# EAGLE design 223_gas (EAGLE 9.6.2)
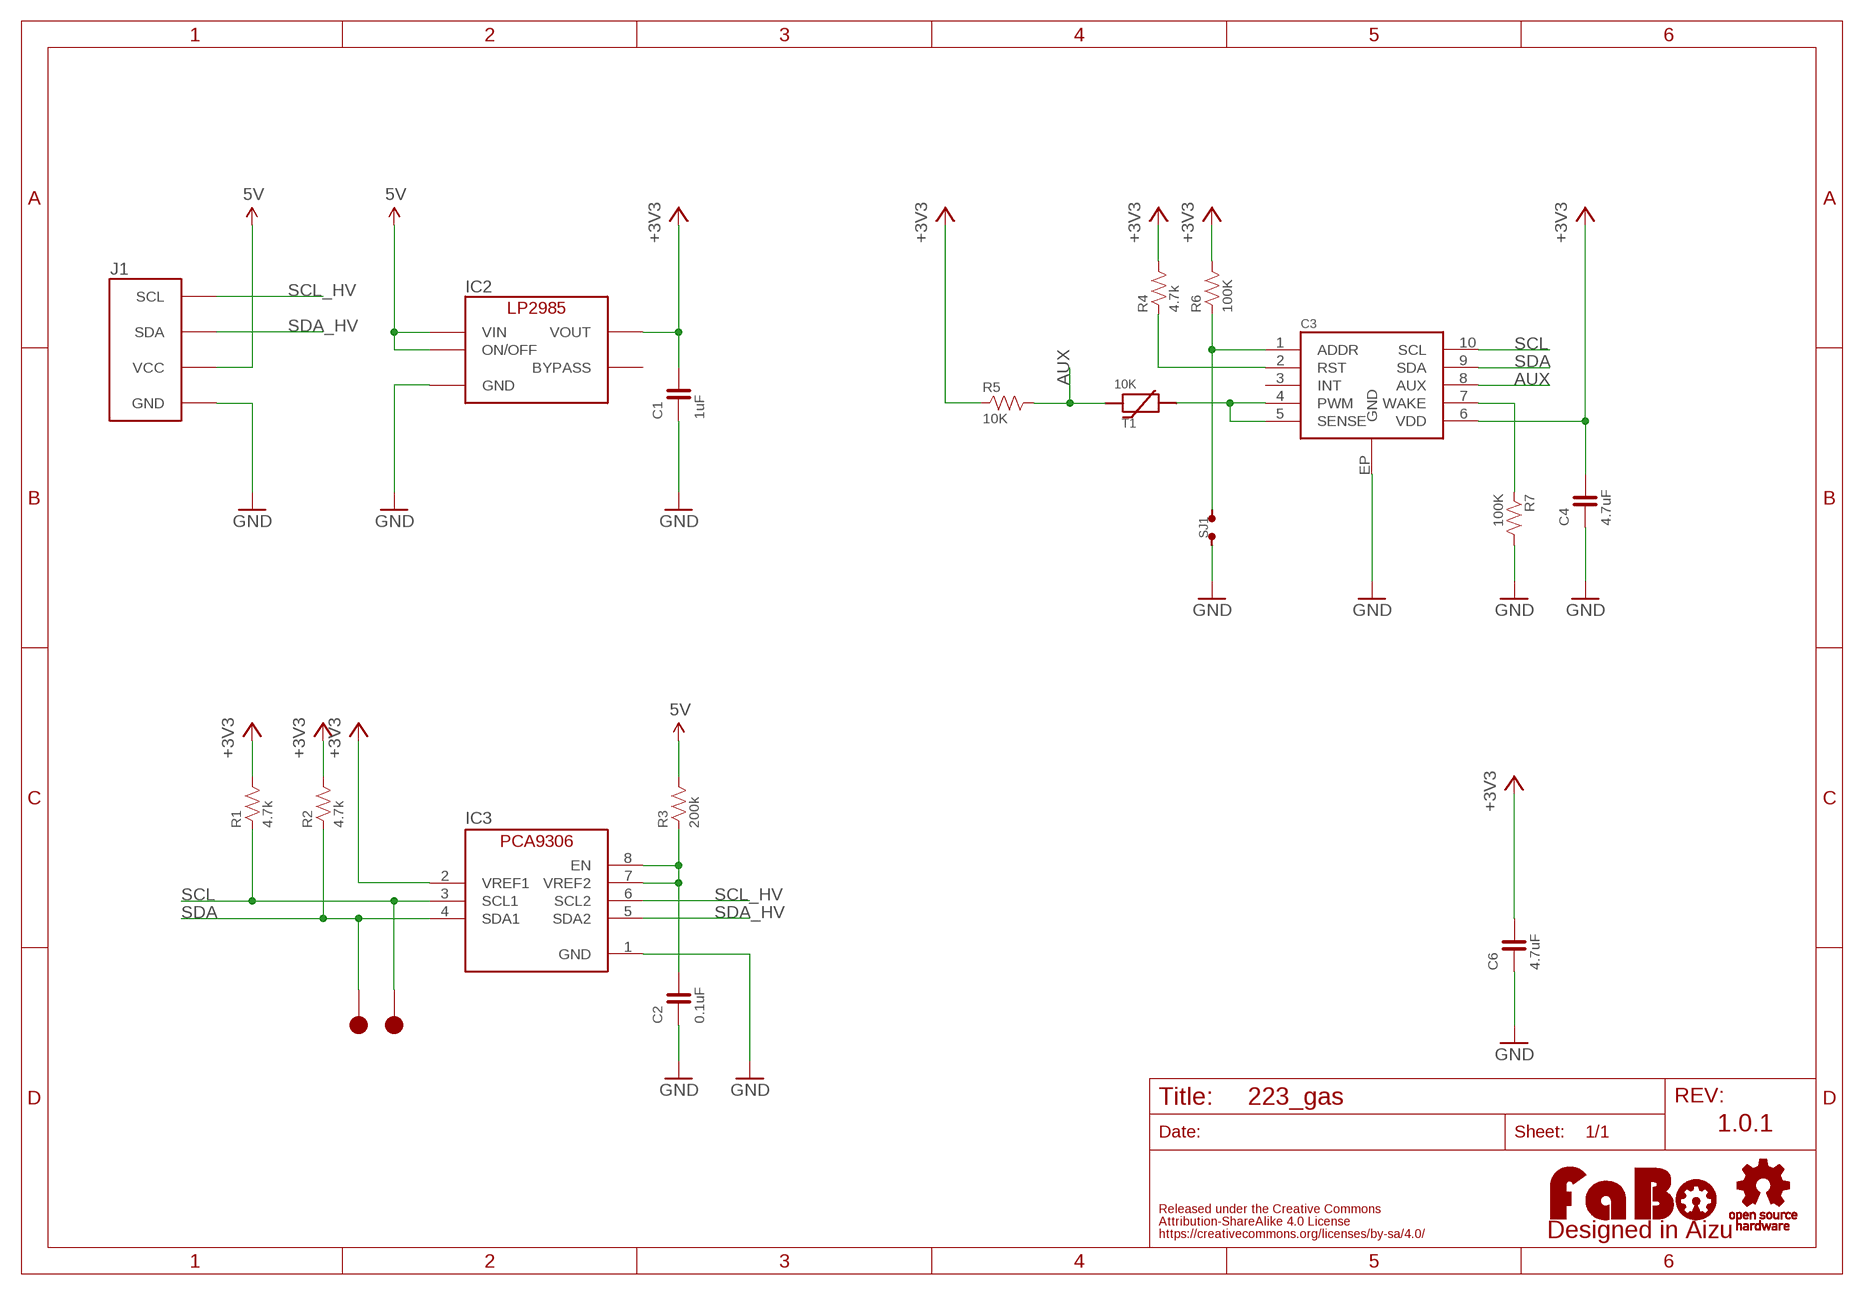
[diagram p0: schematic, sheet 1]

## Parts
C1  1uF  CAPACITOR-0603  [0603]
C2  0.1uF  CAPACITOR-0603  [0603]
C3  AM-CSS811  [AMS-CSS811]
C4  4.7uF  CAPACITOR-0603  [0603]
C6  4.7uF  CAPACITOR-0603  [0603]
IC2  LP2985-33DBV  [SOT-23-5]
IC3  PCA9306GM  [XQFN8]
J1  FABO_BRICK_I2C  [FABO_BRICK_I2C]
LOGO1  LOGO_FABO-M  [LOGO_FABO_M]
R1  4.7k  RESISTOR-0603  [0603]
R2  4.7k  RESISTOR-0603  [0603]
R3  200k  RESISTOR-0603  [0603]
R4  4.7k  RESISTOR-0603  [0603]
R5  10K  RESISTOR-0603  [0603]
R6  100K  RESISTOR-0603  [0603]
R7  100K  RESISTOR-0603  [0603]
SJ1  SMD-JUMPER-2-OPEN  [SMD-JUMPER-2-OPEN]
T1  10K  TERMISTOR  [0603]
TP1  TP-15  [TP-15]
TP2  TP-15  [TP-15]
U$2  LOGO_OSHW-M_BOTTOM  [LOGO_OSHW_M_BOTTOM]

## Nets
5V: IC2.1(VIN) IC2.3(ON/OFF) J1.VCC R3.2
+3V3: C1.2 C3.6(VDD) C4.2 C6.2 IC2.5(VOUT) IC3.2(VREF1) R1.2 R2.2 R4.2 R5.1 R6.2
AUX: C3.8(AUX) R5.2 T1.1
GND: C1.1 C2.1 C3.EP(GND) C4.1 C6.1 IC2.2(GND) IC3.1(GND) J1.GND R7.2 SJ1.1
N$1: C2.2 IC3.7(VREF2) IC3.8(EN) R3.1
N$2: C3.4(PWM) C3.5(SENSE) T1.2
N$3: C3.7(WAKE) R7.1
N$4: C3.2(RST) R4.1
N$5: C3.1(ADDR) R6.1 SJ1.2
SCL: C3.10(SCL) IC3.3(SCL1) R1.1 TP2.1
SCL_HV: IC3.6(SCL2) J1.SCL
SDA: C3.9(SDA) IC3.4(SDA1) R2.1 TP1.1
SDA_HV: IC3.5(SDA2) J1.SDA
Unconnected: C3.3(INT) IC2.4(BYPASS)

## Notes on the sheet
- 1.0.1

## Library data of the parts
C1 C2 C4 C6 = FaBo-Capacitor:CAPACITOR: CAPACITOR
C3 = FaBo-Mems:AM-CSS811
IC2 = FaBo-Supply:LP2985: LP2985
IC3 = FaBo-LevelTranslator:PCA9306
J1 = FaBo-Template:FABO_BRICK_I2C: FaBo Brick I2C
LOGO1 = component:LOGO_FABO
R1-R7 = FaBo-Resistors:RESISTOR: RESISTOR
SJ1 = FaBo-Supply:SMD-JUMPER-2
T1 = FaBo-Thermistors:TERMISTOR
TP1 TP2 = FaBo-Supply:TP
U$2 = component:LOGO_OSHW

## Board
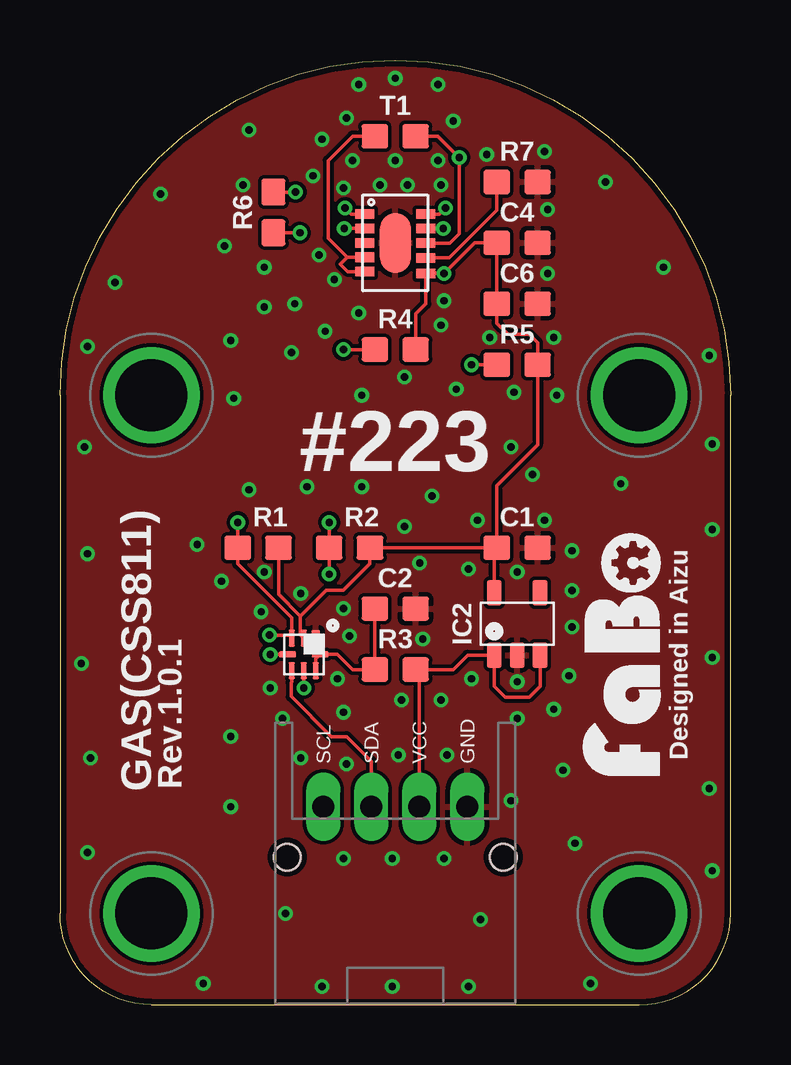
[diagram p1: board, top side]
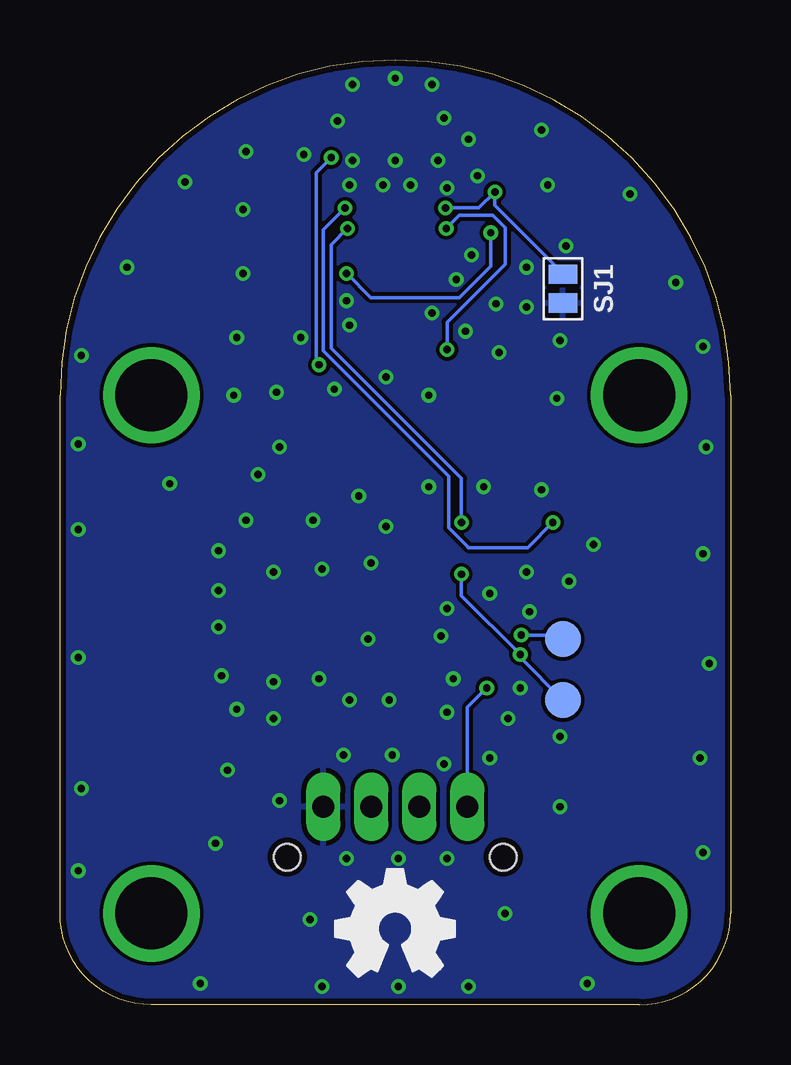
[diagram p2: board, bottom side, seen from below]

Size 27.94 x 39.37 mm. Coordinates in mm from the lower left corner, seen from the top.
Copper layers (1*16): Top 0.035mm / dielectric 1.6mm / Bottom 0.035mm
Design rules "PCBway": minimum track width 6mil, minimum drill 12mil, track to track 6mil, track to pad 6mil, pad to pad 6mil, via to via 6mil, smd to smd 6mil, copper to edge 10mil, drill to drill 10mil, minimum pad ring 10mil, minimum via ring 6mil, stop-mask expansion 2mil, vias tented up to drill 100mil, thermal gap 8mil

### Footprints (pad centres in the part's own frame; a part is rotated, then mirrored left to right if it is on the bottom)
0603 = smd 1.1 x 1: 1 -0.85,0; 2 0.85,0
AMS-CSS811 = smd 0.8 x 0.4: 1 -1.27,1.2; 2 -1.27,0.6; 3 -1.27,0; 4 -1.27,-0.6; 5 -1.27,-1.2; 6 1.27,-1.27; 7 1.27,-0.625; 8 1.27,-0.006; 9 1.27,0.6; 10 1.27,1.2 | smd 1.3 x 2.5: EP 0,0
SOT-23-5 = smd 0.6 x 1.05: 1 -0.95,-1.3; 2 0,-1.3; 3 0.95,-1.3; 4 0.95,1.3; 5 -0.95,1.3
XQFN8 = smd 0.7 x 0.35: 1 -0.675,0.5 | smd 0.7 x 0.25: 2 -0.675,0; 3 -0.675,-0.5; 5 0.675,-0.5; 6 0.675,0; 7 0.675,0.5 | smd 0.25 x 0.7: 4 0,-0.675; 8 0,0.675
FABO_BRICK_I2C = drill 0.9 pad 1.422 long: GND 3,-10.795; SCL -3,-10.795; SDA -1,-10.795; VCC 1,-10.795 | drill 3 pad 3.81: P$1 -10.16,6.35; P$2 10.16,6.35; P$3 -10.16,-15.24; P$4 10.16,-15.24 | hole 1.1: -4.5,-12.895; 4.5,-12.895
SMD-JUMPER-2-OPEN = smd 0.8 x 1.2: 1 -0.6,0; 2 0.6,0
TP-15 = smd 1.5 x 1.5: 1 0,0

### Placement (x,y rotation side)
C1  19.05,19.05 180 top
C2  13.97,16.51 180 top
C3  13.97,31.75 0 top
C4  19.05,31.75 180 top
C6  19.05,29.21 180 top
IC2  19.05,15.88 0 top
IC3  10.16,14.61 270 top
J1  13.97,19.05 0 top
LOGO1  25.4,14.61 90 top
R1  8.26,19.05 0 top
R2  12.06,19.05 0 top
R3  13.97,13.97 0 top
R4  13.97,27.3 0 top
R5  19.05,26.67 180 top
R6  8.89,33.02 270 top
R7  19.05,34.29 0 top
SJ1  6.99,29.84 90 bottom
T1  13.97,36.2 180 top
TP1  6.99,12.7 0 bottom
TP2  6.99,15.24 0 bottom
U$2  13.97,3.17 0 top

### Tracks (layer width: path | path; a pad name or v marks a point on that pad's centre or on a via)
5V
  Top 0.152: IC2.3 20,13.27 19.56,12.83 18.54,12.83 18.1,13.27 IC2.1 16.99,14.57 16.38,13.97 R3.2 14.97,13.82 J1.VCC
+3V3  (via drill 0.3)
  Top 0.152: IC2.5 18.1,18.95 | 18.1,18.95 C1.2 18.2,21.63 19.9,23.33 R5.1 19.9,27.6 19.56,27.94 18.67,27.94 18.2,28.41 C6.2 C4.2 17.27,31.75 v16,30.48 C3.6 15.24,29.21 14.82,28.79 R4.2 | R1.2 9.11,17.11 10.01,16.2 | IC3.2 10.01,15.43 10.01,16.2 | R6.2 v9.99,32.17 | 10.01,16.2 11.09,17.27 11.81,17.27 12.91,18.38 R2.2 18,19.05 18.1,18.95
  Bottom 0.152: v9.99,32.17 9.99,30.77 11.3,29.46 14.99,29.46 v16,30.48
AUX  (via drill 0.3)
  Top 0.152: C3.8 16.25,31.74 16.64,32.13 v16.64,35.31 15.75,36.2 T1.1 | R5.2 v17.14,26.67
  Bottom 0.152: v17.14,26.67 17.27,26.8 17.27,34.67 v16.64,35.31
GND  (via drill 0.3)
  other vias: 19.05,13.46 8.51,18.03 10.03,17.14 11.81,34.04 10.54,34.54 12.19,35.18 11.94,36.96 10.92,36.07 13.34,34.16 14.48,34.16 15.88,34.16 15.75,35.18 13.97,35.18 17.78,35.43 16.38,36.83 13.97,38.61 15.75,38.35 12.45,38.35 10.79,31.24 11.43,30.23 12.45,28.83 16,29.34 15.88,28.32 11.05,28.07 8.51,30.73 9.78,29.21 7.62,34.16 6.86,31.62 8.51,29.08 7.11,27.69 9.65,27.18 14.35,26.16 20.32,30.48 20.32,33.15 20.19,35.56 17.91,27.81 20.57,27.81 18.92,25.53 20.7,25.4 16.51,25.65 18.8,23.24 19.68,22.1 17.4,20.19 20.19,20.19 19.05,18.03 21.34,18.92 21.34,17.27 21.34,15.75 17.02,18.16 14.35,19.94 14.99,18.41 21.21,13.72 19.05,11.94 20.57,12.32 17.14,13.59 15.88,12.7 14.22,12.7 15.11,15.24 11.81,16.51 12.06,15.37 11.56,13.59 11.81,12.19 16.13,10.41 14.1,10.41 11.94,10.03 10.03,10.29 9.27,11.94 8.76,13.21 7.11,11.18 11.81,6.1 13.84,6.1 16,6.1 18.8,8.51 20.95,9.78 7.11,8.26 1.14,6.35 5.97,0.89 10.92,0.76 13.84,0.76 17.02,0.76 22.1,0.89 27.18,5.59 21.46,6.73 17.53,3.56 9.4,3.81 27.18,14.48 27.18,19.81 27.05,9.02 23.37,21.72 27.18,23.37 12.57,21.59 10.29,21.59 8.38,16.38 6.73,17.65 5.71,19.18 7.87,21.46 12.57,25.4 7.24,25.27 27.05,27.05 1.14,27.43 1.02,23.24 0.89,14.22 1.14,18.8 1.27,10.29 22.73,34.29 25.15,30.73 4.19,33.78 7.87,36.45 2.29,30.1 15.49,21.21
  pour Bottom: 0,0 0,39.37 27.94,39.37 27.94,0
  pour Top: 0,0 27.94,0 27.94,39.37 0,39.37
N$1
  Top 0.152: IC3.7 10.66,14.43 IC3.8 11.56,14.61 12.19,13.97 R3.1 C2.2
N$2
  Top 0.152: C3.4 11.97,31.15 | 11.97,31.15 11.68,30.86 11.99,30.55 C3.5 | T1.2 12.19,36.2 11.18,35.18 11.18,31.95 11.97,31.15
N$3
  Top 0.152: C3.7 16.22,31.12 18.2,33.11 R7.1
N$4  (via drill 0.3)
  Top 0.152: C3.2 v11.85,32.35 | R4.1 v11.81,27.3
  Bottom 0.152: v11.85,32.35 11.3,32.89 9.91,32.89 9.4,32.38 9.4,30.86 11.81,28.45 v11.81,27.3
N$5  (via drill 0.3)
  Top 0.152: C3.1 12.13,32.95 v11.88,33.2 | v9.82,33.87 R6.1
  Bottom 0.152: v11.88,33.2 10.48,33.2 v9.82,33.87 9.82,33.31 6.99,30.48 SJ1.2
SCL  (via drill 0.3)
  Top 0.152: 9.66,15.37 9.66,16.12 7.41,18.38 R1.1 v7.41,20.11 | 9.66,15.37 IC3.3 | v8.72,15.41 9.62,15.41 9.66,15.37 | C3.10 15.8,32.95 v16.06,33.2
  Bottom 0.152: v8.72,15.41 7.15,15.41 TP2.1 | v16.06,33.2 16.97,32.3 16.97,27.25 11.75,22.04 11.75,19.88 10.92,19.06 10.92,19.05 8.46,19.05 v7.41,20.11
SCL_HV  (via drill 0.3)
  Top 0.152: IC3.6 v10.16,13.21
  Bottom 0.152: v10.16,13.21 10.97,12.4 J1.SCL
SDA  (via drill 0.3)
  Top 0.152: IC3.4 v8.76,14.61 | v11.21,17.95 R2.1 v11.21,20.11 | C3.9 v15.97,32.35
  Bottom 0.152: TP1.1 8.76,14.48 v8.76,14.61 11.21,17.06 v11.21,17.95 | v15.97,32.35 16.64,31.68 16.64,27.36 11.21,21.93 v11.21,20.11
SDA_HV
  Top 0.152: J1.SDA 12.97,10.14 11.94,11.18 11.3,11.18 9.63,12.85 9.63,13.43 9.66,13.46 IC3.5

### Text on the board
tPlace: #223 | Designed in Aizu | GAS(CSS811) | Rev.1.0.1